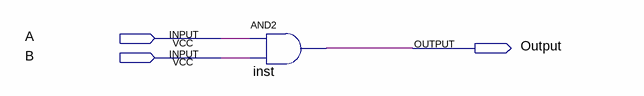
[diagram p0: schematic sheet]
// Quartus schematic And1bit.bdf as structural Verilog: 1 symbols, 3 pins
module And1bit (
  input  A,
  input  B,
  output Output
);

  and inst (Output, A, B);
endmodule
